# EAGLE board Fuel Cell Controller V1 (EAGLE 7.7.0)
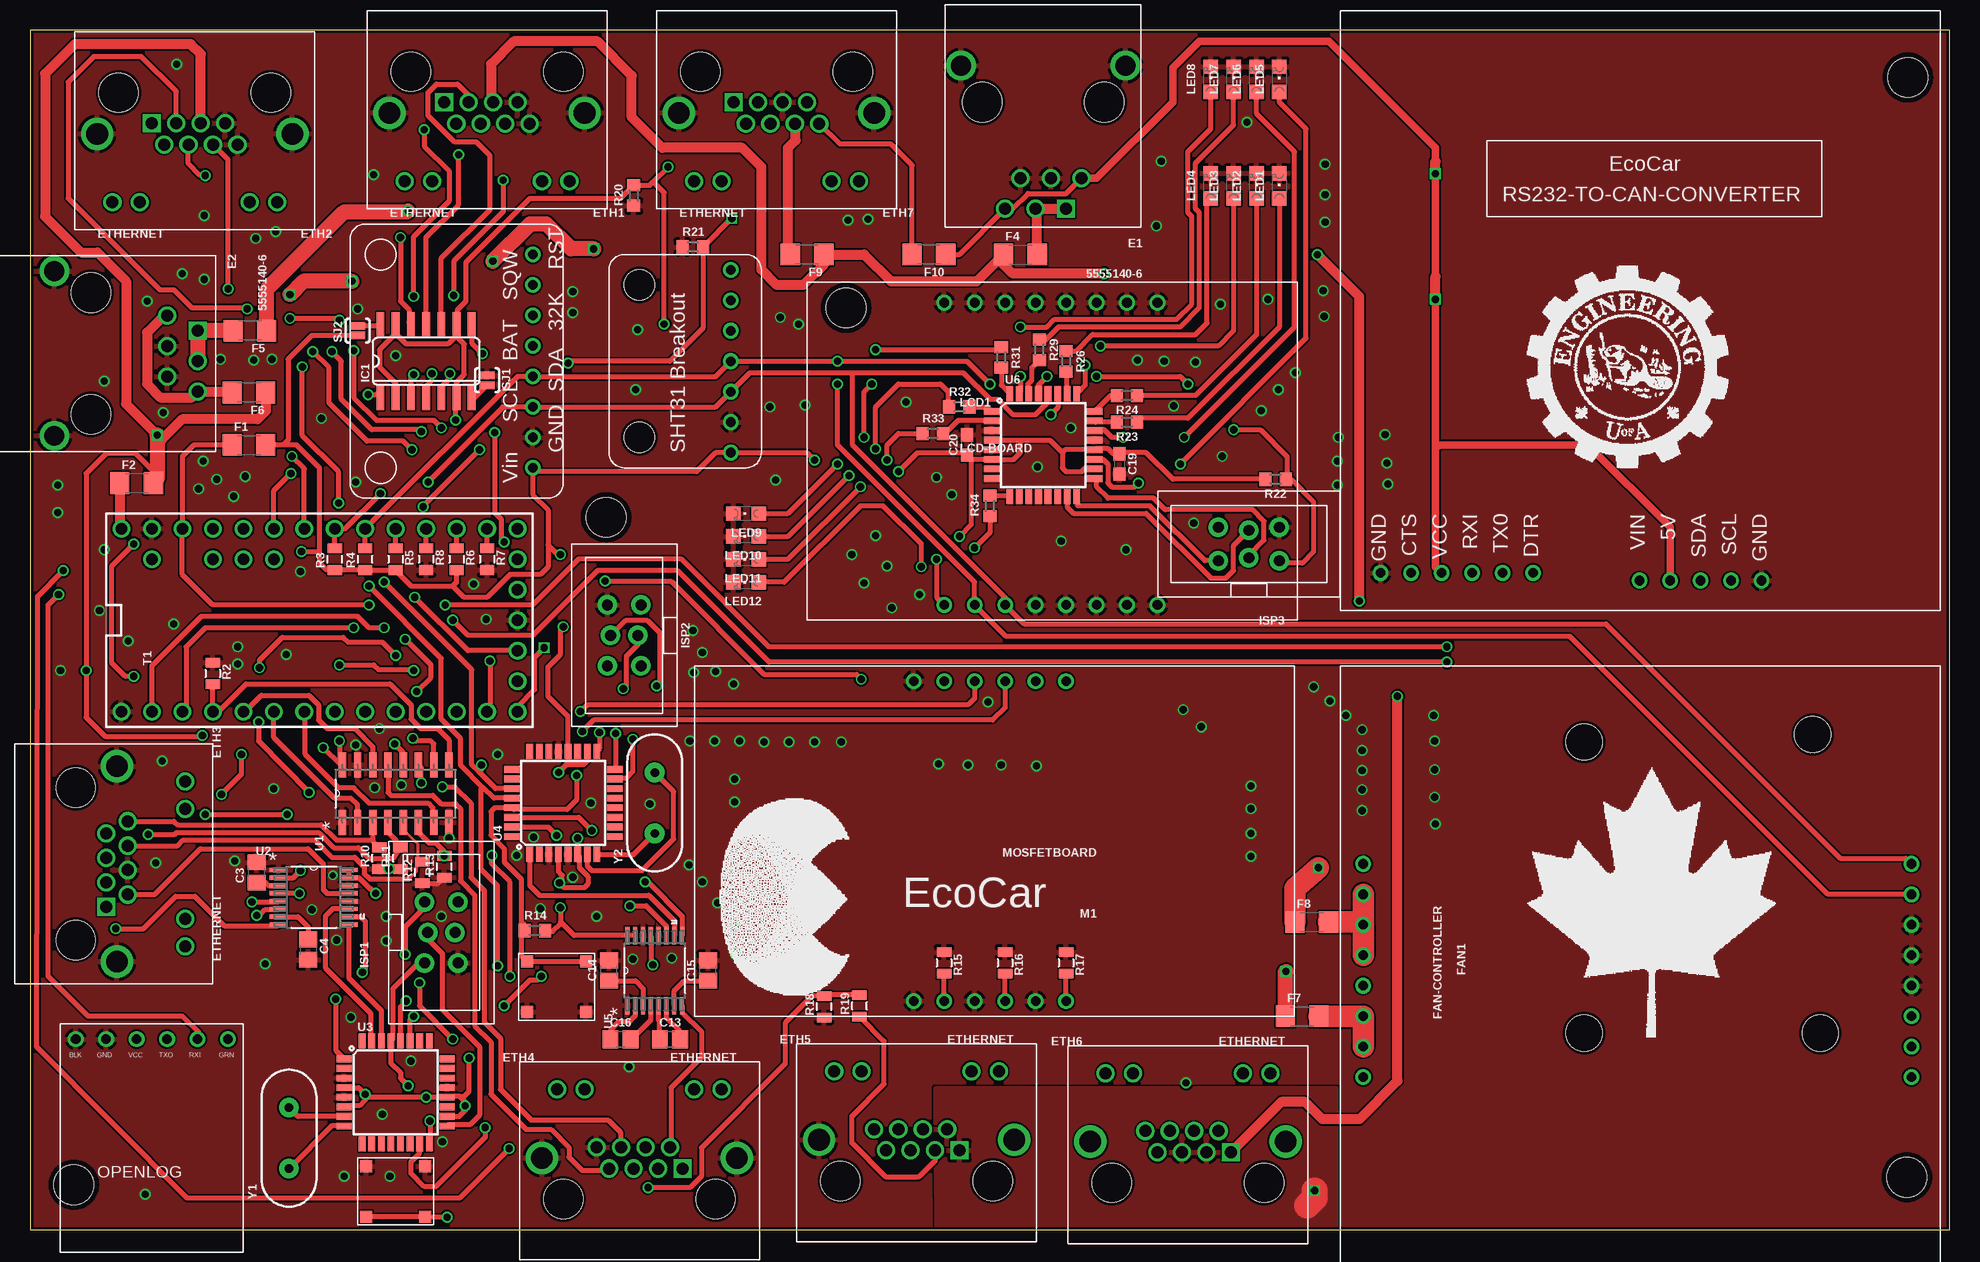
[diagram p7: board, top side]
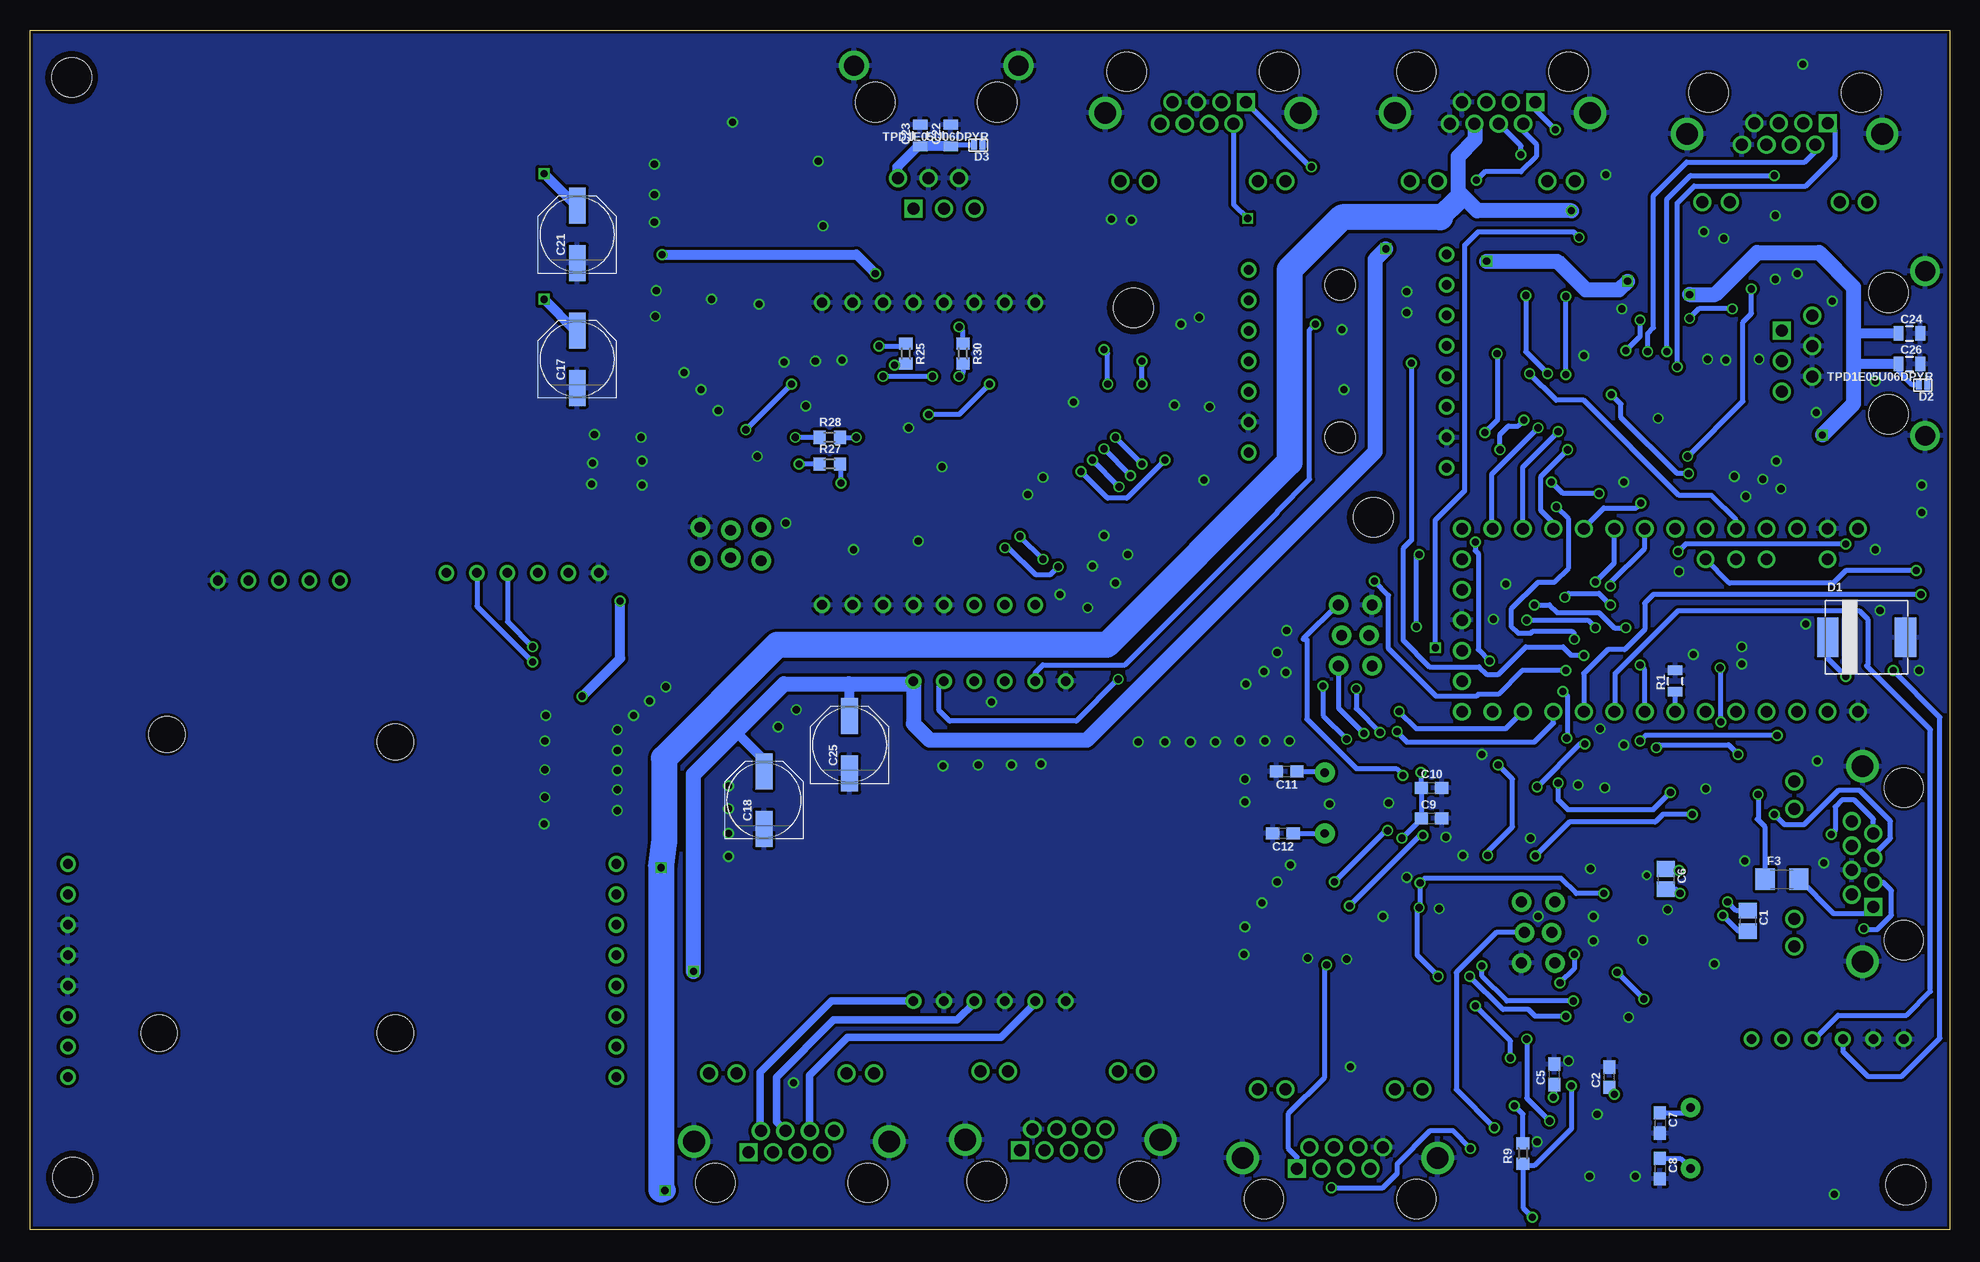
[diagram p8: board, bottom side, seen from below]

Size 160 x 100 mm. Coordinates in mm from the lower left corner, seen from the top.
Outline: 0,0 160,0 160,100 0,100 0,0
Copper layers (1*16): Top 0.035mm / dielectric 1.5mm / Bottom 0.035mm
Design rules "SeeedStudio_2layer_DRU_no_angle_20140221": minimum track width 6mil, minimum drill 12mil, track to track 6mil, track to pad 6mil, pad to pad 6mil, via to via 6mil, smd to smd 0mil, copper to edge 10mil, drill to drill 10mil, minimum pad ring 10mil, minimum via ring 6mil, stop-mask expansion 2mil, vias tented up to drill 100mil, thermal gap 10mil

## Footprints (pad centres in the part's own frame; a part is rotated, then mirrored left to right if it is on the bottom)
C0805 = smd 1.3 x 1.5: 1 -0.85,0; 2 0.85,0
C0603 = smd 1.1 x 1: 1 -0.85,0; 2 0.85,0
PANASONIC_D = smd 3 x 1.4: + 2.4,0; - -2.4,0
0805 = smd 0.8 x 1.2: 1 -0.9,0; 2 0.9,0
RS232-TO-CAN-CONVERTER = drill 0.8: 5V 47.498,27.495; CTS 46.863,5.905; DTR 46.863,16.066; GND 46.863,3.365; GND_ 47.498,35.115; RXI 46.863,10.986; SCL 47.498,32.575; SDA 47.498,30.035; TX0 46.863,13.525; VCC 46.863,8.445; VIN 47.498,24.956
DO-214AB = smd 1.778 x 3.302: A 3.239,0; C -3.239,0
2-XDFN = smd 0.5 x 0.8: P$1 0.36,0; P$2 -0.36,0
1734723-1_RJ11 = drill 1 square: 1 -2.54,2.54 | drill 1: 2 0,2.54; 3 2.54,2.54; 4 -3.81,0; 5 -1.27,0; 6 1.27,0 | drill 1.65: SH1 -7.5,-9.4; SH2 6.22,-9.4 | hole 3.3: -5.72,-6.35; 4.44,-6.35
A122645-ND = drill 1 square: P$1 3.58,2.54 | drill 1: P$2 2.56,4.32; P$3 1.54,2.54; P$4 0.52,4.32; P$5 -0.5,2.54; P$6 -1.52,4.32; P$7 -2.54,2.54; P$8 -3.56,4.32; P$9 -6.86,9.14; P$10 -4.57,9.14; P$11 4.57,9.14; P$12 6.86,9.14 | drill 1.8: P$13 -8.13,3.43; P$14 8.13,3.43 | hole 3.25: -6.35,0; 6.35,0
1206 = smd 1.6 x 1.8: 1 -1.4,0; 2 1.4,0
FAN-CONTROLLER = drill 0.8: 5 31.75,1.905; 5_2 29.21,1.905; 12 19.05,1.905; 12_2 21.59,1.905; 12_3 24.13,1.905; GND 21.59,47.625; GND2 24.13,47.625; GND3 26.67,47.625; P$6 29.21,47.625; P$7 31.75,47.625; P$8 34.29,47.625; P$9 16.51,1.905; P$13 26.67,1.905; P$16 34.29,1.905; SCL 16.51,47.625; SDA 19.05,47.625 | hole 3: 6.35,20.32; 30.615,20.32; 5.715,39.37; 30.615,40.005
SO14 = smd 0.66 x 2.032: 1 -3.81,-3.073; 2 -2.54,-3.073; 3 -1.27,-3.073; 4 0,-3.073; 5 1.27,-3.073; 6 2.54,-3.073; 7 3.81,-3.073; 8 3.81,3.073; 9 2.54,3.073; 10 1.27,3.073; 11 0,3.073; 12 -1.27,3.073; 13 -2.54,3.073; 14 -3.81,3.073
AVRISP-BOX = drill 0.9 pad 1.626: 1 -1.397,2.54; 2 1.397,2.54; 3 -1.143,0; 4 1.143,0; 5 -1.397,-2.54; 6 1.397,-2.54
LCD-BOARD = drill 0.8: GND1 11.43,26.467; GND2 13.97,26.467; GND3 16.51,26.467; GND4 19.05,26.467; GND5 21.59,26.467; GND6 24.13,26.467; GND7 26.67,26.467; GND8 29.21,26.467; GND9 19.05,1.27; GND10 21.59,1.27; GND11 24.13,1.27; GND12 26.67,1.27; GND13 29.21,1.27; SCL 16.51,1.27; SDA 13.97,1.27; V 11.43,1.27
CHIPLED_0805 = smd 1.2 x 1.2: A 0,-1.05; C 0,1.05
MOSFET-BOARD = drill 0.8: ESTOP 29.21,1.27; GND 21.59,27.94; GND1 26.67,27.94; GND2 31.75,27.94; IN1 21.59,1.27; IN2 24.13,1.27; IN3 26.67,1.27; OUT1 19.05,27.94; OUT2 24.13,27.94; OUT3 29.21,27.94; VDD 19.05,1.27; VSS 31.75,1.27
OPENLOG = drill 0.8: P$1 -6.35,-8.255; P$2 -3.81,-8.255; P$3 -1.27,-8.255; P$4 1.27,-8.255; P$5 3.81,-8.255; P$6 6.35,-8.255
R0603 = smd 1 x 1.1: 1 -0.85,0; 2 0.85,0
DS3231 = drill 0.8: P$1 2.54,2.54; P$2 5.08,2.54; P$3 7.62,2.54; P$4 10.16,2.54; P$5 12.7,2.54; P$6 15.24,2.54; P$7 17.78,2.54; P$8 20.32,2.54
EG4621CT-ND = smd 1 x 1: P$1 -2.475,2.1; P$2 2.475,2.1; P$3 -2.475,-2.1; P$4 2.475,-2.1
SHT31-BREAKOUT = drill 0.8: ADR 11.43,2.54; ALR 16.51,2.54; GND 3.81,2.54; RST 13.97,2.54; SCL 6.35,2.54; SDA 8.89,2.54; VIN 1.27,2.54 | hole 2.54: 2.54,10.16; 15.24,10.16
PAD-JUMPER-2-NC_BY_PASTE_YES_SILK = smd 0.635 x 1.27: 1 -0.401,0; 2 0.413,0
STAND-OFF = hole 3.302: 0,0
TEENSY3-ALL_PINS = drill 0.965: 0 -7.62,13.97; 1 -7.62,11.43; 2 -7.62,8.89; 3 -7.62,6.35; 3.3V 7.62,11.43; 3.3V1 -2.54,-16.51; 4 -7.62,3.81; 5 -7.62,1.27; 6 -7.62,-1.27; 7 -7.62,-3.81; 8 -7.62,-6.35; 9 -7.62,-8.89; 10 -7.62,-11.43; 11 -7.62,-13.97; 12 -7.62,-16.51; 13 7.62,-16.51; 14/A0 7.62,-13.97; 15/A1 7.62,-11.43; 16/A2 7.62,-8.89; 17/A3 7.62,-6.35; 18/A4 7.62,-3.81; 19/A5 7.62,-1.27; 20/A6 7.62,1.27; 21/A7 7.62,3.81; 22/A8 7.62,6.35; 23/A9 7.62,8.89; A10 5.08,6.35; A11 5.08,3.81; AGND 7.62,13.97; AREF 5.08,8.89; GND -7.62,16.51; GND1 0,-16.51; PGM 2.54,-16.51; RESET/DAC 5.08,-16.51; VBAT -5.08,-16.51; VIN 7.62,16.51; VUSB 5.08,13.97
SOIC127P600X175-16N = smd 2.057 x 0.61: 1 -4.801,8.89; 2 -4.801,7.62; 3 -4.801,6.35; 4 -4.801,5.08; 5 -4.801,3.81; 6 -4.801,2.54; 7 -4.801,1.27; 8 -4.801,0; 9 0,0; 10 0,1.27; 11 0,2.54; 12 0,3.81; 13 0,5.08; 14 0,6.35; 15 0,7.62; 16 0,8.89
SOP65P640X120-16N = smd 1.473 x 0.356: 1 -2.921,2.286; 2 -2.921,1.626; 3 -2.921,0.965; 4 -2.921,0.33; 5 -2.921,-0.33; 6 -2.921,-0.965; 7 -2.921,-1.626; 8 -2.921,-2.286; 9 2.921,-2.286; 10 2.921,-1.626; 11 2.921,-0.965; 12 2.921,-0.33; 13 2.921,0.33; 14 2.921,0.965; 15 2.921,1.626; 16 2.921,2.286
TQFP32-08 = smd 1.27 x 0.559: 1 -4.293,2.8; 2 -4.293,2; 3 -4.293,1.2; 4 -4.293,0.4; 5 -4.293,-0.4; 6 -4.293,-1.2; 7 -4.293,-2; 8 -4.293,-2.8; 17 4.293,-2.8; 18 4.293,-2; 19 4.293,-1.2; 20 4.293,-0.4; 21 4.293,0.4; 22 4.293,1.2; 23 4.293,2; 24 4.293,2.8 | smd 0.559 x 1.27: 9 -2.8,-4.293; 10 -2,-4.293; 11 -1.2,-4.293; 12 -0.4,-4.293; 13 0.4,-4.293; 14 1.2,-4.293; 15 2,-4.293; 16 2.8,-4.293; 25 2.8,4.293; 26 2,4.293; 27 1.2,4.293; 28 0.4,4.293; 29 -0.4,4.293; 30 -1.2,4.293; 31 -2,4.293; 32 -2.8,4.293
HC49US = drill 0.7 pad 1.651: 1 -2.54,0; 2 2.54,0

## Placement (x,y rotation side)
C1  0.1uF/12V  [C0805]  16.83,25.72 270 bottom
C2  10uF  [C0603]  28.34,12.7 90 bottom
C3  0.1uF/12V  [C0805]  18.89,29.77 90 top
C4  0.1uF/12V  [C0805]  23.18,23.34 270 top
C5  0.1uF  [C0603]  32.94,12.94 90 bottom
C6  0.1uF/12V  [C0805]  23.65,29.21 270 bottom
C7  22pF  [C0603]  24.13,8.89 270 bottom
C8  22pF  [C0603]  24.13,5.08 270 bottom
C9  0.1uF  [C0603]  43.18,34.29 0 bottom
C10  10uF  [C0603]  43.18,36.83 0 bottom
C11  22pF  [C0603]  55.24,38.18 180 bottom
C12  22pF  [C0603]  55.56,33.02 180 bottom
C13  0.1uF/12V  [C0805]  53.34,15.88 0 top
C14  0.1uF/12V  [C0805]  48.26,21.59 90 top
C15  0.1uF/12V  [C0805]  56.52,21.59 90 top
C16  0.1uF/12V  [C0805]  49.21,15.88 0 top
C17  100uF  [PANASONIC_D]  114.38,72.55 90 bottom
C18  100uF  [PANASONIC_D]  98.82,35.8 90 bottom
C19  0.1uF  [C0603]  90.81,63.82 270 top
C20  10uF  [C0603]  78.11,65.41 90 top
C21  100uF  [PANASONIC_D]  114.38,82.95 90 bottom
C22  10uF  [0805]  83.26,91.2 90 bottom
C23  10uF  [0805]  85.8,91.2 90 bottom
C24  10uF  [0805]  3.33,74.69 0 bottom
C25  100uF  [PANASONIC_D]  91.68,40.4 90 bottom
C26  10uF  [0805]  3.33,72.15 0 bottom
CAN1  RS232-TO-CAN-CONVERTER  [RS232-TO-CAN-CONVERTER]  109.22,101.6 270 top
D1  SMBJ3V3(digikey)  [DO-214AB]  6.91,49.37 0 bottom
D2  TPD1E05U06DPYR  [2-XDFN]  2.22,70.41 180 bottom
D3  TPD1E05U06DPYR  [2-XDFN]  80.96,90.41 180 bottom
E1  5555140-6  [1734723-1_RJ11]  83.82,87.63 180 top
E2  5555140-6  [1734723-1_RJ11]  11.43,72.39 270 top
ETH1  ETHERNET  [A122645-ND]  38.1,96.52 180 top
ETH2  ETHERNET  [A122645-ND]  13.73,94.77 180 top
ETH3  ETHERNET  [A122645-ND]  3.81,30.48 270 top
ETH4  ETHERNET  [A122645-ND]  50.8,2.54 0 top
ETH5  ETHERNET  [A122645-ND]  73.9,4.05 0 top
ETH6  ETHERNET  [A122645-ND]  96.52,3.89 0 top
ETH7  ETHERNET  [A122645-ND]  62.23,96.52 180 top
F1  [1206]  18.26,65.41 0 top
F2  [1206]  8.89,62.23 0 top
F3  [1206]  13.97,29.21 0 bottom
F4  [1206]  82.55,81.28 0 top
F5  [1206]  18.34,74.93 180 top
F6  [1206]  18.26,69.77 180 top
F7  [1206]  106.05,17.78 0 top
F8  [1206]  106.84,25.64 0 top
F9  [1206]  64.77,81.28 180 top
F10  [1206]  74.93,81.28 180 top
FAN1  FAN-CONTROLLER  [FAN-CONTROLLER]  109.22,46.99 270 top
FRAME1  FRAME-LETTERNO_PACKAGE  [DUMMY]  -1.27,2.54 0 top
FRAME2  FRAME-LETTERNO_PACKAGE  [DUMMY]  -1.27,2.54 0 top
FRAME3  FRAME-LETTERNO_PACKAGE  [DUMMY]  -1.27,2.54 0 top
FRAME4  FRAME-LETTERNO_PACKAGE  [DUMMY]  0,1.27 0 top
FRAME5  FRAME-LETTERNO_PACKAGE  [DUMMY]  -1.27,2.54 0 top
FRAME6  FRAME-LETTERNO_PACKAGE  [DUMMY]  -1.27,2.54 0 top
FRAME7  FRAME-LETTERNO_PACKAGE  [DUMMY]  -1.91,1.91 0 top
IC1  4081D  [SO14]  33.02,72.39 0 top
ISP1  AVRISP-BOX  [AVRISP-BOX]  34.29,24.77 0 top
ISP2  AVRISP-BOX  [AVRISP-BOX]  49.53,49.53 180 top
ISP3  AVRISP-BOX  [AVRISP-BOX]  101.6,57.15 90 top
LCD1  LCD-BOARD  [LCD-BOARD]  64.77,50.8 0 top
LED1  [CHIPLED_0805]  104.14,87 0 top
LED2  [CHIPLED_0805]  102.23,87 0 top
LED3  [CHIPLED_0805]  100.33,87 0 top
LED4  [CHIPLED_0805]  98.42,87 0 top
LED5  [CHIPLED_0805]  104.14,95.89 0 top
LED6  [CHIPLED_0805]  102.23,95.89 0 top
LED7  [CHIPLED_0805]  100.33,95.89 0 top
LED8  [CHIPLED_0805]  98.42,95.89 0 top
LED9  [CHIPLED_0805]  59.69,59.69 90 top
LED10  [CHIPLED_0805]  59.69,57.78 90 top
LED11  [CHIPLED_0805]  59.69,55.88 90 top
LED12  [CHIPLED_0805]  59.69,53.98 90 top
M1  MOSFETBOARD  [MOSFET-BOARD]  105.41,46.99 180 top
O1  OPENLOG  [OPENLOG]  10.16,7.62 180 top
R1  10k  [0805]  22.86,45.72 90 bottom
R2  10k  [0805]  15.24,46.35 270 top
R3  4.7k  [0805]  25.4,55.88 90 top
R4  4.7k  [0805]  27.94,55.88 90 top
R5  1M  [0805]  30.48,55.88 270 top
R6  1M  [0805]  35.56,55.88 270 top
R7  1M  [0805]  38.1,55.88 270 top
R8  1M  [0805]  33.02,55.88 270 top
R9  10k  [R0603]  35.56,6.35 90 bottom
R10  10k  [0805]  29.13,30.96 90 top
R11  10k  [0805]  30.88,30.96 90 top
R12  10k  [0805]  32.7,29.77 90 top
R13  10k  [0805]  34.53,30.24 90 top
R14  10k  [R0603]  42.07,24.92 0 top
R15  10k  [0805]  76.2,22.23 270 top
R16  10k  [0805]  81.28,22.23 270 top
R17  10k  [0805]  86.36,22.23 270 top
R18  10k  [0805]  66.2,18.57 90 top
R19  10k  [0805]  69.14,18.65 90 top
R20  10k  [R0603]  50.32,86.2 90 top
R21  10k  [R0603]  55.24,81.92 0 top
R22  10k  [R0603]  103.82,62.55 180 top
R23  100  [R0603]  91.44,67.31 180 top
R24  100  [R0603]  91.44,69.53 180 top
R25  100  [R0603]  87,73.03 270 bottom
R26  100  [R0603]  86.36,72.39 270 top
R27  100  [R0603]  93.34,63.82 0 bottom
R28  100  [R0603]  93.34,66.04 0 bottom
R29  100  [R0603]  84.14,73.34 270 top
R30  100  [R0603]  82.23,73.03 270 bottom
R31  100  [R0603]  80.96,72.71 270 top
R32  100  [R0603]  77.47,68.58 0 top
R33  100  [R0603]  75.25,66.36 0 top
R34  100  [R0603]  80.01,60.33 90 top
RTC1  DS3231  [DS3231]  44.45,60.96 90 top
S1  EG4621CT-ND  [EG4621CT-ND]  30.48,3.17 0 top
S2  EG4621CT-ND  [EG4621CT-ND]  43.89,20.24 180 top
SHT1  SHT31-BREAKOUT  [SHT31-BREAKOUT]  60.96,63.5 90 top
SJ1  JUMPER-PAD-2-NC_BY_PASTE  [PAD-JUMPER-2-NC_BY_PASTE_YES_SILK]  38.1,70.8 270 top
SJ2  JUMPER-PAD-2-NC_BY_PASTE  [PAD-JUMPER-2-NC_BY_PASTE_YES_SILK]  27.3,74.93 90 top
STANDOFF1  STAND-OFF  [STAND-OFF]  156.45,4.37 0 top
STANDOFF2  STAND-OFF  [STAND-OFF]  3.65,3.73 0 top
STANDOFF3  STAND-OFF  [STAND-OFF]  156.53,96.04 0 top
STANDOFF4  STAND-OFF  [STAND-OFF]  48.02,59.37 0 top
STANDOFF5  STAND-OFF  [STAND-OFF]  68.02,76.83 0 top
T1  TEENSY_3.1_ALL_PINS  [TEENSY3-ALL_PINS]  24.13,50.8 90 top
U1  SN74ALS153D  [SOIC127P600X175-16N]  34.92,38.73 90 top
U2  MAX3221CPWR  [SOP65P640X120-16N]  23.65,27.7 0 top
U3  ATMEGA328P_TQFP  [TQFP32-08]  30.48,11.43 0 top
U4  ATMEGA328P_TQFP  [TQFP32-08]  44.45,35.56 90 top
U5  MAX3221CPWR  [SOP65P640X120-16N]  52.07,21.59 90 top
U6  ATMEGA328P_TQFP  [TQFP32-08]  84.45,65.41 0 top
Y1  [HC49US]  21.59,7.62 90 top
Y2  [HC49US]  52.07,35.56 90 top

## Tracks (layer width: path | path; a pad name or v marks a point on that pad's centre or on a via)
+3.3V  (via drill 0.6)
  Top 0.406: 35.24,53.66 31.75,53.66 30.48,54.93 R5.2 R4.1 R3.1 24.71,54.98 24.13,55.56 24.13,56.59 | 35.24,53.66 35.56,53.98 R6.2 | 24.13,56.59 24.13,63.5 22.23,65.41 21.11,65.41 | 21.11,65.41 F1.2 | 86.04,64.77 86.28,65 U6.20 88.83,65.09 89.85,65.09 90.27,64.67 C19.1 90.91,64.77 93.03,64.77 95.25,62.55 R22.2 | 86.04,64.77 86.04,63.5 86.36,63.18 87.63,63.18 87.95,63.5 88.65,63.5 U6.18 | U6.4 82.55,65.81 | 82.55,65.81 85.01,65.81 86.04,64.77 | 82.55,65.81 82.55,64.77 81.98,64.2 U6.6 78.45,64.2 | 78.45,64.2 C20.1 77.89,64.77 73.98,64.77 v72.39,63.18 | 78.45,64.2 78.45,58.77 v77.47,57.78 | v75.56,55.88 75.56,52.7 LCD1.V | v65.41,64.14 64.77,64.77 SHT1.VIN 57.15,64.77 55.56,63.18 42.23,63.18 RTC1.P$1 41.91,61.28 43.18,60.01 43.18,57.07 | 43.18,57.07 43.18,55.24 42.55,54.61 40.01,54.61 38.1,52.7 36.2,52.7 35.24,53.66 | SJ2.1 23.49,74.53 21.51,72.55 21.51,65.8 21.11,65.41 | v44.45,50.24 44.21,50.01 44.21,47.94 43.18,46.91 43.18,44.45 44.85,42.78 U4.20 44.93,39.78 44.93,38.81 45.01,38.73 | v44.21,56.28 43.97,56.28 43.18,57.07 | U3.4 27.38,11.83 v27.94,11.27 | v27.94,11.27 27.94,10.79 | 27.94,10.79 27.46,10.32 26.28,10.32 U3.6 | U4.18 46.45,39.07 46.12,38.73 45.01,38.73 | 45.01,38.73 44.69,38.73 v44.05,38.1 | v45.64,32.62 U4.6 45.8,31.12 45.8,30.16 46.51,29.45 46.51,28.81 46.2,28.5 44.53,28.5 v44.13,28.89 | U4.4 44.05,29.84 44.37,29.53 44.37,29.13 v44.13,28.89 | v44.21,26.83 44.21,25.64 | 44.21,25.64 44.21,25.48 43.58,24.84 43,24.84 R14.2 | U5.15 U5.16 45.34,24.51 44.21,25.64 | U2.16 U2.15 27.43,29.33 28.34,28.42 28.42,28.42 v28.81,28.02 | U3.18 35.78,9.43 36.27,9.92 v36.27,10.32 36.27,10.64 35.8,11.11
  Top 0.406: 35.8,11.11 34.85,11.11 U3.20 v33.02,11.03 28.34,11.03 | 28.34,11.03 28.18,11.03 27.94,10.79 | v27.94,11.27 28.1,11.27 28.34,11.03 | 35.8,11.11 36.2,11.11 36.59,11.51 v36.59,14.29 | v39.53,18.65 41.67,20.8 42.31,20.8 v42.62,21.11 | 44.29,28.73 v44.13,28.89 | v8.65,46.12 7.94,46.12 6.83,47.23 6.83,55.32 v8.65,57.15 | v22.62,56.52 24.05,56.52 24.13,56.59
  Bottom 0.406: v77.47,57.78 v75.56,55.88 | v65.41,64.14 68.58,60.96 70.17,60.96 v72.39,63.18 | v44.45,50.24 44.45,56.04 v44.21,56.28 | v44.05,38.1 44.05,36.85 C10.1 C9.1 44.03,34.23 v45.64,32.62 | v28.81,28.02 31.11,28.02 32.38,29.29 43.74,29.29 v44.13,28.89 44.13,26.91 v44.21,26.83 44.37,26.67 44.37,22.86 v42.62,21.11 | C5.1 32.94,11.11 v33.02,11.03 | C2.1 28.34,11.67 v27.94,11.27 | R9.2 35.56,9.6 v36.27,10.32 | v36.59,14.29 36.59,15.72 v39.53,18.65 | D1.C 10.14,47.61 v8.65,46.12 | v8.65,57.15 21.99,57.15 v22.62,56.52
ATMEG1_RESET  (via drill 0.6)
  Top 0.406: ISP1.5 32.38,22.23 30.24,20.08 30.24,15.88 U3.29 30.08,13.89 30.88,13.1 30.88,12.62 v31.51,11.99 | v34.77,1.03 33,1.03 S1.P$4 S1.P$3
  Bottom 0.406: v31.51,11.99 31.51,8.41 34.61,5.32 35.38,5.32 R9.1 35.56,1.83 v34.77,1.03
ATMEG2_RESET  (via drill 0.6)
  Top 0.406: v45.56,37.86 45.56,35.8 44.77,35 40.31,35 U4.29 38.73,35.16 38.42,34.85 38.42,32.86 39.53,31.75 39.53,30.64 40.96,29.21 40.96,25.64 | 40.96,25.64 40.96,22.8 S2.P$4 S2.P$3 | R14.1 41.22,25.38 40.96,25.64
  Bottom 0.406: ISP2.5 51.04,52.07 53.9,49.21 53.74,49.21 53.66,49.13 53.58,49.21 53.58,42.55 49.45,38.42 46.12,38.42 v45.56,37.86
ATMEG3_RESET  (via drill 0.6)
  Top 0.406: ISP3.5 104.33,55.56 106.05,55.56 107,56.52 107,60.64 105.09,62.55 R22.1 104.78,62.65 104.78,64.45 102.55,66.67 v100.33,66.67 | U6.29 84.06,70.4 v84.77,71.12 | v88.9,71.12 95.89,71.12 v96.52,70.48
  Bottom 0.406: v84.77,71.12 v88.9,71.12 | v96.52,70.48 v100.33,66.67
AUX5  (via drill 0.6)
  Top 0.406: F10.1 77.47,81.28 E1.3 81.92,85.09 83.19,86.36 86.36,86.36 E1.4
  Top 0.61: E1.4 88.9,87.63 95.25,93.98 95.25,96.84 97.47,99.06 108.27,99.06 117.16,90.17 117.16,89.06 | v117.16,88.03 117.16,79.45 | v117.16,77.55 117.16,65.09 | CAN1.VCC 117.16,55.24 117.16,65.09 | 117.16,65.09 117.47,65.41 129.86,65.41 136.72,58.55 CAN1.5V
  Top 0.813: v117.16,77.55 117.16,79.45 | v117.16,88.03 117.16,89.06
  Bottom 0.406: D3.P$1 83.16,90.41 C22.1
  Bottom 0.813: C17.+ 114.56,74.95 v117.16,77.55 | C21.+ 114.48,85.35 v117.16,88.03 | C23.1 C22.1 85.99,90.3 87.71,88.58 87.71,87.71 E1.4
AUX12  (via drill 0.6)
  Top 0.813: 80.74,80.87 78.93,79.06 71.75,79.06 69.53,81.28 F9.1 66.17,80.46 64.45,78.74 62.23,78.74 60.96,80.01 60.96,88.58 59.37,90.17 52.7,90.17 50.16,92.71 50.16,96.2 47.31,99.06 40.32,99.06 38.42,97.16 38.42,94.16 ETH1.P$5 | 80.74,80.87 F4.1 | v113.98,44.45 113.98,12.38 110.81,9.21 107.71,9.21 106.28,10.64 104.31,10.64 ETH6.P$1 | v110.81,52.39 110.81,77.79 v107.31,81.28 | v89.53,79.69 81.92,79.69 80.74,80.87
  Bottom 0.813: v110.81,52.39 110.81,47.62 v113.98,44.45 | v107.31,81.28 91.12,81.28 v89.53,79.69
CAP_R  (via drill 0.6)
  Top 0.406: IC1.8 36.83,73.9 v37.7,73.03 | v38.73,66.44 38.73,59.77 39.29,59.21 39.29,57.55 v39.53,57.31 | v38.34,47.39 38.34,43.42 T1.11
  Bottom 0.406: v37.7,73.03 37.7,67.47 v38.73,66.44 | v39.53,57.31 39.53,56.59 39.29,56.36 39.29,48.34 v38.34,47.39
CAP_R_OUT
  Top 0.406: ETH1.P$3 36.51,94.03 36.51,94.61 35.64,95.49 33.89,95.49 33.18,94.77 33.18,92.87 35.4,90.65 37.23,90.65 38.34,89.53 38.34,85.01 34.29,80.96 IC1.10
CAPCURR  (via drill 0.6)
  Top 0.406: R5.1 T1.17/A3 | v25.72,60.56 25.72,63.18 22.7,66.2 v22.7,71.91
  Bottom 0.406: T1.17/A3 30.48,58.5 28.81,60.17 26.11,60.17 v25.72,60.56 | v22.7,71.91 22.7,85.57 21.27,87 11.99,87 9.53,89.46 9.53,91.61 ETH2.P$1
CAPVOLT  (via drill 0.6)
  Top 0.406: R7.1 T1.14/A0 | ETH2.P$3 12.19,94.89 9.29,97.79 5.32,97.79 3.17,95.65 3.17,85.96 10.79,78.34 11.99,78.34 13.49,76.83 18.02,76.83 v18.1,76.76 | v21.67,75.96 25.64,75.96 v25.8,75.8 | v26.99,73.26 26.99,69.37 28.89,67.47 33.66,67.47 v34.29,66.83
  Bottom 0.406: v18.1,76.76 20.88,76.76 v21.67,75.96 | v25.8,75.8 25.8,74.45 v26.99,73.26 | v34.29,66.83 38.18,62.94 38.18,58.5 T1.14/A0
CHARGE_R  (via drill 0.6)
  Top 0.406: T1.12 40.64,43.58 42.07,45.01 42.07,47.7 v42.86,48.5 | v30.88,82.71 30.88,77.39 31.59,76.68 31.59,75.62 IC1.12
  Bottom 0.406: v42.86,48.5 42.86,59.13 40.4,61.59 40.4,82.07 39.29,83.19 31.35,83.19 v30.88,82.71
CHARGE_R_OUT  (via drill 0.6)
  Top 0.406: IC1.11 33.02,82.71 35.72,85.41 v35.72,89.61
  Bottom 0.406: v35.72,89.61 35.72,90.34 ETH1.P$4
CVM_SER_INVALID  (via drill 0.6)
  Top 0.406: U2.10 27.58,26.08 27.94,25.72 27.94,21.67 v27.7,21.43 | 25.8,14.62 U3.1 25.48,14.94 v25.48,19.21
  Bottom 0.406: v27.7,21.43 v25.48,19.21
CVMRX
  Top 0.406: U2.9 26.57,20.97 29.29,18.26 29.29,15.73 U3.30
CVMRX12  (via drill 0.6)
  Top 0.406: v7.14,25.08 9.45,25.08 12.14,27.78 13.73,27.78 16.19,25.32 20.64,25.32 U2.8
  Bottom 0.406: ETH3.P$3 5.52,28.94 4.84,28.26 4.84,26.19 6.03,25 7.06,25 v7.14,25.08
CVMSIG1  (via drill 0.6)
  Top 0.406: U1.6 32.38,33.1 33.26,32.23 33.81,32.23 34.37,31.67 | 34.37,31.67 R13.2 34.53,31.51 34.37,31.67 | v14.61,34.61 v21.43,34.61
  Bottom 0.406: ETH3.P$5 6.35,31.19 4.92,32.62 4.92,34.05 7.46,36.59 9.29,36.59 12.14,33.73 13.73,33.73 v14.61,34.61 | v21.43,34.61 23.89,34.61 24.53,33.97 31.7,33.97 R13.2
  other vias: 34.53,31.14
CVMSIG2
  Top 0.254: 31.11,33.1 31.35,33.1 32.31,32.15 32.31,31.06 R12.2 32.23,30.19 32.23,29.84 31.59,29.21
  Top 0.406: U1.5 31.11,33.1 | ETH3.P$6 12.31,32 12.78,32.46 23.73,32.46 25.16,31.04 27.07,31.04 27.86,30.24 27.86,29.69 28.34,29.21 31.59,29.21
CVMSIG3  (via drill 0.6)
  Top 0.406: U1.4 29.84,33.1 30.48,32.46 30.48,31.94 R11.2 30.29,30.96 28.26,30.96 27.38,31.83 25.32,31.83 24.05,33.1 12.22,33.1 12.06,32.94 v9.84,32.94
  Bottom 0.406: ETH3.P$7 6.35,34.21 7.94,35.8 8.97,35.8 9.53,35.24 9.53,33.26 v9.84,32.94
CVMSIG4
  Top 0.406: U1.3 28.57,32.41 | 28.57,32.41 R10.2 | ETH3.P$8 12,34.04 12.3,33.73 24.29,33.73 25.56,32.46 28.52,32.46 28.57,32.41
CVMTX
  Top 0.406: U2.11 25.23,26.74 24.61,26.11 24.61,21.83 28.42,18.02 28.42,15.79 U3.31
CVMTX12
  Top 0.406: ETH3.P$2 10.38,27.92 14.21,31.75 23.18,31.75 24.45,30.48 24.45,28.34 24.77,28.02 26.56,28.02 U2.13
EXTRA_SIG  (via drill 0.6)
  Top 0.406: v58.5,84.3 58.48,84.3 R21.2 56.09,75.14 53.34,72.39 45.01,72.39 v44.85,72.23 | v19.05,42.31 19.05,40.72 v23.26,36.43 | v32.62,37.23 32.62,38.5 U1.11 | v19.13,46.83 19.13,47.47 21.03,49.37 26.11,49.37 26.51,48.97 29.37,48.97 v30.48,47.86
  Bottom 0.406: ETH7.P$2 59.67,85.47 v58.5,84.3 | v44.85,72.23 44.85,57.47 45.56,56.75 45.56,49.13 43.34,46.91 39.21,46.91 38.58,46.28 37.62,46.28 35.32,48.58 32.23,48.58 31.51,47.86 v30.48,47.86 | v32.62,37.23 32.62,35.8 31.83,35 24.69,35 v23.26,36.43 | v19.05,42.31 19.05,46.75 v19.13,46.83
EXTRA_V  (via drill 0.6)
  Top 0.406: M1.IN3 78.74,44.29 78.18,43.74 46.43,43.74 v45.88,43.18
  Bottom 0.406: v45.88,43.18 44.45,41.75 36.99,41.75 T1.10
EXTRA_V_G
  Top 0.406: M1.OUT3 R15.2
  Bottom 0.61: M1.OUT3 76.2,18.89 79.06,16.03 91.84,16.03 95.01,12.86 95.01,8.22 ETH6.P$6
FC5  (via drill 0.6)
  Top 0.406: F2.2 10.29,63.21 8.81,64.69 6.35,64.69 4.68,63.02 v4.68,46.59 4.68,42.7 6.27,41.12 14.29,41.12 v14.37,41.2 | v25.8,40.72 25.8,38.97 U1.16 25.88,38.73 v24.45,40.16 | v17.62,39.61 17.62,37.94 v15.95,36.27
  Top 0.813: F6.1 19.66,68.23 18.97,67.55 12.7,67.55 10.99,65.84 | 10.99,65.84 10.48,65.33 10.48,62.42 F2.2 | ETH2.P$5 14.23,98 13.41,98.82 3.73,98.82 1.27,96.36 1.27,84.45 4.29,81.44 5.64,81.44 8.02,79.06 8.02,68.82 v10.6,66.24 10.99,65.84
  Top 1.27: F7.1 104.64,21.46 v104.7,21.51 | v46.99,81.76 45.09,81.76 43.02,83.82 41.67,83.82 v38.58,80.72 | v26.83,79.06 22.78,79.06 v21.67,77.95 | v10.6,66.24 10.6,62.54 F2.2
  Bottom 0.406: v14.37,41.2 25.32,41.2 v25.8,40.72 | v24.45,40.16 24.21,40.4 18.41,40.4 v17.62,39.61 | O1.P$4 8.89,14.84 6.83,12.78 3.97,12.78 0.79,15.95 0.79,42.7 v4.68,46.59 | F3.1 15.37,33.55 16.03,34.21 15.95,34.29 v15.95,36.27 | D2.P$1 3.1,70.41 4.21,71.52 4.21,72.12 C26.1
  Bottom 0.813: C18.+ 98.82,39.13 101.16,41.47 | C25.+ 91.68,45.4 91.76,45.48 | C24.1 7.54,74.69 8.02,75.17 | C26.1 7.94,72.15 8.02,72.07
  Bottom 1.27: v104.7,21.51 104.7,37.94 101.16,41.47 97.16,45.48 91.76,45.48 86.6,45.48 M1.VDD 86.36,42.15 85.01,40.8 71.91,40.8 47.86,64.85 47.86,80.88 v46.99,81.76 | v38.58,80.72 32.7,80.72 30.32,78.34 27.54,78.34 v26.83,79.06 | v21.67,77.95 19.53,77.95 16.03,81.44 10.87,81.44 8.02,78.58 8.02,75.17 8.02,72.07 8.02,68.82 v10.6,66.24
FC12  (via drill 0.6)
  Top 1.27: F5.1 19.74,78.39 26.19,84.85 31.43,84.85 v31.51,84.93
  Top 1.778: F8.1 105.44,28.45 v107.39,30.16
  Top 2.184: v107.08,3.25 107.08,2.62 106.44,1.98
  Bottom 1.27: v31.51,84.93 39.37,84.93 40.96,86.52 | 40.96,86.52 40.96,89.46 39.53,90.88 39.53,92.11 ETH1.P$6 | 40.96,86.52 40.96,85.88
  Bottom 1.778: 40.96,85.88 42.47,84.38 | 107.39,3.33 v107.08,3.25
  Bottom 2.184: 42.47,84.38 50.64,84.38 55.01,80.01 55.01,63.98 70.25,48.74 97.71,48.74 107.16,39.29 107.16,32.15 v107.39,30.16 107.39,3.33
  pour Top (rank 2): 75.56,-0.16 108.9,-0.16 108.9,11.75 75.49,11.75
FCC_R  (via drill 0.6)
  Top 0.406: T1.20/A6 22.86,63.42 v21.83,64.45 | v16.51,78.42 16.51,89.2 ETH2.P$6
  Bottom 0.406: v21.83,64.45 17.22,69.06 17.22,75.64 16.51,76.36 v16.51,78.42
FCCURR  (via drill 0.6)
  Top 0.406: R6.1 T1.15/A1 | v32.62,66.52 32.54,66.52 32.38,66.67 28.5,66.67 25.96,69.22 25.96,72.39 v25.16,73.18
  Bottom 0.406: T1.15/A1 35.56,63.58 v32.62,66.52 | v25.16,73.18 25.16,74.69 24.69,75.17 24.69,86.2 21.91,88.98 12.06,88.98 11.19,89.85 11.19,90.43 ETH2.P$2
FCPRES  (via drill 0.6)
  Top 0.406: R19.2 66.28,19.55 R18.2 65.19,19.47 62.94,17.22 62.94,13.81 55.96,6.83 55.96,4.45 55.01,3.49 v51.51,3.49 | v2.78,54.93 0.64,52.78 0.56,15.24 13.1,2.62 35.8,2.62 v39.93,6.75
  Bottom 0.406: v2.78,54.93 8.65,54.93 9.68,53.9 18.34,53.9 T1.A11 | v51.51,3.49 47.23,3.49 46.04,4.68 46.04,5.48 43.26,8.26 41.43,8.26 v39.93,6.75
FCVOLT  (via drill 0.6)
  Top 0.406: R8.1 T1.16/A2 | v31.83,65.01 31.11,65.72 28.1,65.72 24.92,68.9 24.92,71.83 v23.57,73.18 | v14.61,87.87 14.21,87.87 13.18,88.9 13.18,90.42 ETH2.P$4
  Bottom 0.406: T1.16/A2 33.02,58.9 34.05,59.93 34.05,62.79 v31.83,65.01 | v23.57,73.18 23.57,85.88 21.59,87.87 v14.61,87.87
GND  (via drill 0.5, 0.6)
  Top 0.406: v29.92,30.08 29.13,30.08 R10.1 | R12.1 34.05,28.87 R13.1
  other vias: 101.44,92.31 36.99,53.82 86.76,66.83 27.15,40.4 20.32,36.75 29.13,41.75 28.73,36.83 38.97,39.61 40.56,31.19 45.24,29.37 49.93,13.57 50.24,22.54 53.5,22.62 11.03,39.05 19.61,22.15 10.48,30.56 17.07,30.72 29.69,26.11 29.69,24.05 23.5,26.67 15.56,62.55 22.54,54.85 24.29,67.63 27.15,62.31 30.48,72.87 50.48,70.01 73.03,68.98 75.56,62.71 83.98,63.58 79.85,43.97 51.67,35.48 46.75,35.56 21.35,47.94 99.38,64.45 97.16,72.31 95.33,68.66 99.22,77.15 103.19,77.55 97,58.9 91.36,56.67 85.96,57.39 93.9,83.66 94.3,89.06 69.85,84.22 68.18,84.14 62.55,76.04 64.06,75.49 61.67,68.58 64.61,68.74 62.15,62.47 50.64,75.01 45.24,78.18 45.24,76.44 17.94,62.79 18.81,82.63 20.48,83.19 14.53,84.53 2.3,62.07 2.3,59.77 11.99,50.48 8.18,49.05 2.54,46.59 5.79,51.59 17.3,48.58 17.3,47.15 56.04,48.1 57.15,46.51 29.37,9.6 26.75,17.7 9.6,2.94 96.36,12.22 38.02,50.88 30.96,37.07 34.92,32.62 41.99,32.7 47.23,26.11 31.75,14.05 25.24,29.53 25.56,24.13 34.29,26.11 34.37,7.3 30,4.45 26.19,4.45 117.08,38.34 117.08,36.04 117.16,33.81 117.08,40.72 101.76,36.99 101.76,35.08 101.76,33.02 101.76,31.11 107,45.24 108.35,44.05 109.7,42.86 111.05,41.67 111.05,39.93 111.05,38.26 111.05,36.67 111.05,34.92 117,42.86 55.32,46.43 58.66,45.48 67.63,40.64 65.41,40.64 63.26,40.64 61.2,40.64 59.13,40.72 57.07,40.72 55.01,40.72 55.24,49.93 70.48,57.86 68.5,56.28 71.83,51.83 74.14,52.94 69.53,53.9 71.44,55.32 58.74,37.54 58.74,35.64 54.93,30.4 56.04,28.97 57.31,27.23 58.74,25.24 58.82,22.94 83.9,38.66 80.96,38.73 78.18,38.73 42.55,26.75 18.65,72.47 20.16,72.55 15.88,72.55 14.53,79.22 12.7,79.69 9.76,77.39 11.11,68.1 6.19,70.72 16.99,61.12 14.45,64.06 14.05,61.75 6.19,56.67 27.3,76.76 28.65,87.95 94.54,72.39 92.31,72.47 102.63,68.26 104.06,70.01 105.49,71.44 107.79,78.26 107.87,76.12 107.95,83.98 107.95,86.28 107.95,88.82 76.83,61.28 112.95,66.28 113.11,63.9 113.19,62.15 109.06,66.04 108.98,64.06 108.98,62.07 97.63,41.91 96.12,43.34 75.72,38.81 12.22,97.16
  pour Bottom (isolate 0.254, rank 6): -3.81,104.78 162.56,104.78 162.56,-3.81 -3.81,-3.81
  pour Top (isolate 0.152, rank 6): -3.81,105.41 165.74,105.41 165.74,-3.17 -3.81,-3.17
H2_OK  (via drill 0.6)
  Top 0.406: IC1.13 30.48,74.69 | 30.48,74.69 29.13,73.34 29.13,71.91 30.48,70.56 IC1.2 | U1.10 33.66,40.48 33.42,40.72 32.15,40.72 v31.91,40.96 | v32.23,44.85 33.42,46.04 33.42,47.07 v31.27,49.21 | v32.78,60.25 32.78,60.33 v37.47,65.01 | v35.48,67.47 35.48,69.24 IC1.6 35.56,70.64 36.2,71.28 36.2,73.82 35.64,74.37 35.64,74.61 | 35.64,75.38 IC1.9 | 35.64,75.38 35.64,74.61 | 35.64,74.61 34.85,73.82 31.35,73.82 30.48,74.69 | 35.64,75.38 35.64,76.68 36.35,77.39 36.35,80.64 41.67,85.96 49.24,85.96 R20.2 51.65,87.05 51.95,87.35 | 51.95,87.35 v53.18,88.58 | v52.86,75.49 52.86,86.44 51.95,87.35
  Bottom 0.406: v31.91,40.96 31.83,41.04 31.83,44.45 v32.23,44.85 | v31.27,49.21 31.27,49.69 31.43,49.85 34.77,49.85 34.92,49.69 35.96,49.69 36.51,50.24 36.51,51.75 34.29,53.98 32.94,53.98 31.75,55.17 31.75,59.21 v32.78,60.25 | v37.47,65.01 37.47,66.28 36.75,66.99 35.96,66.99 v35.48,67.47 | v53.18,88.58 53.25,88.58 ETH7.P$1 | M1.ESTOP 76.2,46.43 75.56,47.07 68.74,47.07 56.04,59.77 56.04,59.85 53.34,62.55 53.34,75.01 v52.86,75.49
M_SER_INVALID
  Top 0.406: U4.1 41.65,28.68 42.47,27.86 51.59,27.86 53.74,25.72 53.74,24.55 U5.10
M_SIG_1  (via drill 0.6)
  Top 0.406: U1.12 31.11,39.77 v30.4,40.48 | v34.37,36.91 35.4,36.91 36.75,35.56 36.75,29.37 37.86,28.26 37.86,17.3 39.21,15.95 39.21,11.67 41.75,9.13 48.18,9.13 49.21,8.1 49.21,6.93 ETH4.P$6
  Bottom 0.406: v30.4,40.48 30.8,40.48 v34.37,36.91
M_SIG_2
  Top 0.406: U1.13 29.84,36.43 30.08,36.2 33.58,36.2 34.29,35.48 35.48,35.48 35.88,35.08 35.88,29.05 37.07,27.86 37.07,16.99 38.42,15.64 38.42,11.27 41.35,8.33 43.42,8.33 44.93,6.83 44.93,6.03 46.04,4.92 48.1,4.92 ETH4.P$7
MISO1  (via drill 0.6)
  Top 0.406: ISP1.1 32.89,26.86 31.27,25.24 v31.27,22.94 | v32.46,20.56 32.46,18.65 v35.24,15.88 | v33.34,9.05 33.34,7.2 U3.16
  Bottom 0.406: v31.27,22.94 31.27,21.75 v32.46,20.56 | v35.24,15.88 35.24,10.95 v33.34,9.05
MISO2  (via drill 0.6)
  Top 0.406: v48.82,41.35 48.82,38.43 U4.16
  Bottom 0.406: ISP2.1 50.93,43.47 v48.82,41.35
MISO3
  Top 0.406: ISP3.1 97.92,55.75 93.34,60.33 87.31,60.33 87.31,61.05 U6.16
MOSI1  (via drill 0.6)
  Top 0.406: v37.94,8.49 37.94,7.7 33.81,3.57 32.86,3.57 31.75,4.68 31.75,5.64 32.46,6.35 32.46,7.12 U3.15
  Bottom 0.406: ISP1.4 37.78,24.77 41.12,21.43 41.12,11.67 v37.94,8.49
MOSI2  (via drill 0.6)
  Top 0.406: ISP2.4 48.42,49.53 49.69,50.8 51.44,50.8 52.47,49.77 52.47,45.32 v52.23,45.32 | v50.24,40.88 50.24,38.18 49.69,37.62 48.81,37.62 U4.15
  Bottom 0.406: v52.23,45.32 52.23,42.86 v50.24,40.88
MOSI3
  Top 0.406: U6.15 86.45,60.23 87,59.69 93.03,59.69 98.42,54.29 99.69,54.29 100.33,54.93 100.33,57.02 ISP3.4
MOTOR_R  (via drill 0.6)
  Top 0.406: v35,71.36 35,70.96 34.21,70.17 34.21,69.4 IC1.5
  Bottom 0.406: T1.22/A8 17.78,59.13 19.84,61.2 22.54,61.2 30.48,69.14 32.78,69.14 v35,71.36
MOTOR_R_OUT  (via drill 0.6)
  Top 0.406: v39.45,87.47 39.45,84.85 35.32,80.72 v35.32,77.87 | v33.5,71.36 33.5,70.8 33.02,70.33 IC1.4
  Bottom 0.406: ETH1.P$2 35.54,91.58 34.45,90.49 34.45,89.46 35.72,88.19 38.73,88.19 v39.45,87.47 | v35.32,77.87 35.32,73.18 v33.5,71.36
MRX  (via drill 0.6)
  Top 0.406: U4.30 45.73,34.36 v46.83,33.26 | v51.28,28.97 51.51,28.97 54.37,26.11 54.37,24.53 U5.9
  Bottom 0.406: v46.83,33.26 46.99,33.26 v51.28,28.97
MRX12
  Top 0.406: U5.8 54.36,18.11 55.96,16.51 55.96,14.37 53.42,11.83 53.42,7.54 53.26,7.38 53.26,6.96 ETH4.P$2
MTX  (via drill 0.6)
  Top 0.406: U4.31 43.2,33.56 v43.89,32.86 | v50.01,26.99 51.36,26.99 53.02,25.32 53.02,24.52 U5.11
  Bottom 0.406: v43.89,32.86 44.13,32.86 v50.01,26.99
MTX12  (via drill 0.6)
  Top 0.406: U5.13 51.75,24.5 51.75,22.23 v51.91,22.07
  Bottom 0.406: ETH4.P$1 54.38,6.04 55.09,6.75 55.09,9.68 52.07,12.7 52.07,21.91 v51.91,22.07
MULTA
  Top 0.406: T1.3 17.94,43.18 19.29,44.53 23.26,44.53 24.05,43.74 24.05,42.47 24.77,41.75 27.07,41.75 28.57,40.24 U1.14
MULTB
  Top 0.406: U1.2 27.3,35.4 26.75,35.96 25.4,35.96 20.32,41.04 T1.4
MULTO1
  Top 0.406: T1.5 22.94,43.1 22.94,39.61 25.72,36.83 26.99,36.83 28.26,35.56 33.18,35.56 33.58,35.16 33.58,34.01 U1.7
  Bottom 0.406: T1.5 R1.1
MULTO2
  Top 0.406: R2.2 T1.2 15.72,43.18 18.02,45.48 30,45.48 31.75,43.74 31.75,42.55 32.54,41.75 33.97,41.75 34.92,40.8 U1.9
N$1
  Top 0.406: U4.7 46.45,30.31 46.83,29.92 51.04,29.92 53.66,32.54 53.66,36.51 Y2.2
  Bottom 0.406: C11.1 52.15,38.18 Y2.2
N$2
  Top 0.406: U4.8 50.32,31.27 Y2.1
  Bottom 0.406: C12.1 Y2.1
N$3
  Top 0.406: C14.1 50.46,20.74 51.12,20.08 51.12,18.68 U5.3
N$4
  Top 0.406: U3.7 22.32,9.43 Y1.2
  Bottom 0.406: C7.1 22.01,9.74 Y1.2
N$5
  Top 0.406: U3.8 25.14,8.63 Y1.1
  Bottom 0.406: C8.1 22.44,5.93 Y1.1
N$6
  Top 0.406: U5.2 50.44,17.82 49.93,17.3 49.05,17.3 48.42,16.67 48.42,15.93 C16.1
N$7
  Top 0.406: C16.2 50.16,15.88 51.75,17.46 51.75,18.66 U5.4
N$8
  Top 0.406: C13.1 52.49,17.36 52.39,17.46 52.39,18.66 U5.5
N$9
  Top 0.406: U5.6 53.03,17.69 54.13,16.59 54.13,15.93 C13.2
N$10
  Top 0.406: U5.7 53.7,19.88 54.53,20.72 56.49,20.72 C15.1
N$11
  Top 0.813: F9.2 63.37,81.15 63.18,80.96 63.18,90.17 63.82,90.81 63.82,92.13 ETH7.P$6
N$12
  Top 0.406: F10.2 73.53,88.71 71.75,90.49 67.5,90.49 ETH7.P$8
N$13
  Top 1.778: F7.2 FAN1.5_2 FAN1.5
N$14
  Top 1.778: F8.2 110.89,25.64 FAN1.12_2 | FAN1.12_2 FAN1.12_3 | FAN1.12_2 FAN1.12
N$15
  Top 0.813: F4.2 83.95,84.96 E1.2 E1.1
N$16
  Top 0.406: R23.2 88.84,67.31 U6.23
N$18
  Top 0.406: R24.2 90.08,69.53 U6.24
N$19  (via drill 0.6)
  Top 0.406: v87.95,72.07 87.95,70.39 U6.25
  Bottom 0.406: R25.2 87.84,72.17 v87.95,72.07
N$20
  Top 0.406: U6.26 86.45,71.44 R26.2
N$21  (via drill 0.6)
  Top 0.406: U6.19 89.47,64.2 89.85,63.82 89.85,62.23 90.17,61.91 92.08,61.91 v92.39,62.23
  Bottom 0.406: v92.39,62.23 92.39,63.72 R27.2
N$22  (via drill 0.6)
  Top 0.406: v91.12,66.04 90.17,66.04 89.53,66.67 88.82,66.67 U6.22
  Bottom 0.406: R28.2 v91.12,66.04
N$23
  Top 0.813: F2.1 7.49,58.55 T1.VIN
N$24
  Top 1.27: F5.2 E2.1 E2.2
N$25
  Top 0.813: E2.4 11.19,76.2 9.76,74.77 9.76,70.48 10.87,69.37 13.49,69.37 E2.3 16.78,69.85 F6.2
N$26  (via drill 0.6)
  Top 0.406: F1.1 13.65,65.41 12.7,64.45 T1.3.3V 12.7,54.61 15.24,52.07 v28.26,52.07 | T1.3.3V1 36.51,48.26 v32.07,52.7
  Bottom 0.406: v32.07,52.7 31.75,53.02 29.21,53.02 v28.26,52.07
N$27
  Bottom 0.406: F3.2 12.54,29.21 9.68,26.35 6.9,26.35 ETH3.P$1
N$28
  Top 0.406: U6.30 83.19,69.77 83.19,70.48 83.5,70.8 83.5,71.86 R29.2
N$29  (via drill 0.6)
  Top 0.406: v82.55,71.12 82.55,69.79 U6.31
  Bottom 0.406: R30.2 82.23,71.44 v82.55,71.12
N$30
  Top 0.406: R31.2 80.96,70.39 U6.32
N$31
  Top 0.406: R32.2 79.79,68.58 U6.1
N$32
  Top 0.406: R33.2 76.28,66.36 77.39,67.47 80.1,67.47 U6.2
N$33
  Top 0.406: R34.2 81.59,61.17 U6.9
N$34  (via drill 0.6)
  Top 0.406: R34.1 80.01,58.1 v78.74,56.83 | v74.3,55.24 74.3,57.15 71.12,60.33 69.22,60.33 62.87,53.98 LED12.A
  Bottom 0.406: v78.74,56.83 78.42,56.83 76.2,54.61 74.93,54.61 v74.3,55.24
N$35  (via drill 0.6)
  Top 0.406: LED11.A 63.18,55.88 v69.22,61.91 | v71.44,64.14 71.44,65.41 72.39,66.36 R33.1
  Bottom 0.406: v69.22,61.91 v71.44,64.14
N$36  (via drill 0.6)
  Top 0.406: LED10.A 63.18,57.78 v68.26,62.87 | v70.48,65.09 70.48,68.58 72.39,70.48 75.88,70.48 76.52,69.85 76.52,68.68 R32.1
  Bottom 0.406: v68.26,62.87 v70.48,65.09
N$37  (via drill 0.6)
  Top 0.406: LED9.A 63.18,59.69 v67.31,63.82 | v69.53,66.04 69.53,69.85 v70.17,70.48 | v70.48,73.34 80.75,73.34 R31.1
  Bottom 0.406: v67.31,63.82 v69.53,66.04 | v70.17,70.48 70.17,73.03 v70.48,73.34
N$38  (via drill 0.6)
  Top 0.406: v82.55,75.25 84.77,75.25 85.41,75.88 95.57,75.88 96.84,77.15 96.84,84.45 96.52,84.77 96.52,89.85 98.42,91.76 LED8.A
  Bottom 0.406: R30.1 82.23,74.93 v82.55,75.25
N$39
  Top 0.406: LED7.A 100.33,92.08 97.16,88.9 97.16,85.09 97.47,84.77 97.47,76.83 95.89,75.25 85.72,75.25 84.35,73.88 R29.1
N$40  (via drill 0.6)
  Top 0.406: v96.2,66.04 105.41,75.25 105.41,89.85 102.23,93.03 LED6.A
  Bottom 0.406: R28.1 v96.2,66.04
N$41  (via drill 0.6)
  Top 0.406: v95.89,63.82 106.36,74.3 106.36,91.76 104.14,93.98 LED5.A
  Bottom 0.406: R27.1 v95.89,63.82
N$42
  Top 0.406: R26.1 87.21,73.24 88.58,74.61 97.16,74.61 98.11,75.56 98.11,85.63 LED4.A
N$43  (via drill 0.6)
  Top 0.406: LED3.A 100.33,74.93 99.06,73.66 v89.22,73.66
  Bottom 0.406: v89.22,73.66 87.21,73.66 R25.1
N$44
  Top 0.406: LED2.A 102.23,74.61 97.16,69.53 R24.1
N$45
  Top 0.406: LED1.A 104.14,75.25 96.52,67.63 92.61,67.63 R23.1
N$46
  Top 0.406: ETH5.P$3 75.44,5.75 74.06,4.37 71.36,4.37 68.5,7.22 68.5,9.45 71.2,12.14 71.2,15.69 R19.1
N$73
  Top 0.406: C3.1 19.66,28.92 19.92,28.65 20.72,28.65 U2.3
N$74  (via drill 0.6)
  Top 0.406: U2.2 21.95,29.33 v22.54,29.92
  Bottom 0.406: v22.54,29.92 23.99,29.92 C6.1
N$75  (via drill 0.6)
  Top 0.406: v22.46,28.02 20.75,28.02 U2.4
  Bottom 0.406: C6.2 22.8,28.36 v22.46,28.02
N$76  (via drill 0.6)
  Top 0.406: v18.49,27.3 20.67,27.3 U2.5
  Bottom 0.406: C1.1 17.76,26.57 v18.49,27.3
N$77  (via drill 0.6)
  Top 0.406: v18.89,26.19 19.13,26.19 19.61,26.67 20.67,26.67 U2.6
  Bottom 0.406: C1.2 17.57,24.87 v18.89,26.19
N$78
  Top 0.406: U2.7 22.34,26.08 23.18,25.24 C4.1
PURGE_V  (via drill 0.6)
  Top 0.406: M1.IN2 81.28,43.5 80.25,42.47 46.99,42.47 v46.04,41.51
  Bottom 0.406: v46.04,41.51 46.04,41.43 45.24,40.64 34.61,40.64 33.02,42.23 T1.9
PURGE_V_G
  Top 0.406: M1.OUT2 R16.2
  Bottom 0.61: M1.OUT2 81.28,18.89 82.71,17.46 93.03,17.46 97.79,12.7 97.79,8.96 ETH6.P$4
RX1  (via drill 0.6)
  Top 0.406: v118.11,47.31 61.59,47.31 53.98,54.93 47.31,54.93 41.91,49.53 36.51,49.53 v35.24,50.8 | T1.0 10.16,46.99 14.29,51.12 27.3,51.12 28.26,50.16 v29.53,50.16
  Bottom 0.406: CAN1.TX0 122.75,51.94 v118.11,47.31 | v35.24,50.8 30.16,50.8 v29.53,50.16
RX3
  Bottom 0.406: O1.P$3 11.27,15.88 9.29,17.86 3.57,17.86 1.59,19.84 1.59,41.67 6.91,46.99 6.83,47.07 6.83,50.88 7.54,51.59 22.62,51.59 27.86,46.35 27.86,43.26 T1.7
SCK1
  Top 0.406: ISP1.3 33.15,24.24 34.37,23.02 34.37,18.34 37.47,15.24 37.47,9.53 36.67,8.73 34.87,8.73 U3.17
SCK2  (via drill 0.6)
  Top 0.406: ISP2.3 50.67,48.77 49.69,47.78 49.69,45.32 v49.45,45.09 | v47.47,41.43 47.47,40.07 U4.17
  Bottom 0.406: v49.45,45.09 49.45,43.42 v47.47,41.43
SCK3
  Top 0.406: ISP3.3 101.6,56.2 102.87,57.47 102.87,59.05 101.92,60.01 94.61,60.01 93.66,60.96 89.85,60.96 88.9,61.91 88.9,62.45 U6.17
SCL  (via drill 0.6)
  Top 0.406: 39.45,68.58 RTC1.P$3 57.15,68.58 SHT1.SCL 60.01,71.44 68.58,71.44 | 39.45,68.58 39.37,68.58 | R3.2 T1.19/A5 26.27,58.42 v29.21,61.36 | 68.58,71.44 77.79,71.44 80.01,69.22 80.64,69.22 81.92,67.94 83.82,67.94 84.77,68.9 84.77,69.61 U6.28 | 68.58,71.44 68.58,65.41 81.28,52.7 LCD1.SCL 82.87,50.48 131.37,50.48 150.89,30.96 156.37,30.96 FAN1.SCL | U4.28 38.65,35.96 37.74,36.87 | 37.74,36.87 35.88,38.73 35.88,40.96 34.29,42.55 34.29,47.62 v28.26,53.66 | v33.18,62.31 39.45,68.58 | U3.28 30.88,18.58 v31.35,19.05 | v38.97,21.99 38.97,28.65 37.62,30 37.62,36.75 37.74,36.87
  Bottom 0.406: v28.26,53.66 28.26,53.92 R3.2 T1.19/A5 | v29.21,61.36 32.23,61.36 v33.18,62.31 | v31.35,19.05 36.91,19.05 38.97,21.11 v38.97,21.99
SDA  (via drill 0.6)
  Top 0.406: R4.2 T1.18/A4 40.64,71.12 RTC1.P$4 57.15,71.12 SHT1.SDA v67.31,72.39 78.11,72.39 v80.01,70.48 | v85.09,67.94 85.72,68.58 85.72,69.63 U6.27 | v67.31,70.48 67.31,65.41 78.74,53.98 LCD1.SDA 81.12,49.69 81.28,49.53 81.36,49.45 128.35,49.45 149.86,27.94 FAN1.SDA | U4.27 38.8,36.76 37.42,38.14 | 37.42,38.14 36.83,38.73 36.83,46.67 v29.53,53.98 | U3.27 31.68,17.47 v31.99,17.78 | v40.01,21.11 40.01,28.97 38.5,30.48 v38.5,31.19 | v37.62,38.73 37.62,38.34 37.42,38.14
  Bottom 0.406: v80.01,70.48 82.55,67.94 v85.09,67.94 | v67.31,70.48 v67.31,72.39 | v29.53,53.98 27.94,55.56 T1.18/A4 | v31.99,17.78 34.53,17.78 35.08,18.34 37.23,18.34 v40.01,21.11 | v38.5,31.19 38.5,31.51 36.43,33.58 36.43,37.54 v37.62,38.73
START_R  (via drill 0.6)
  Top 0.406: T1.21/A7 20.32,61.59 v21.75,63.02 | v28.18,69.61 28.89,69.61 29.13,69.85 29.13,69.4 IC1.1
  Bottom 0.406: v21.75,63.02 22.7,63.02 27.38,67.71 27.38,68.82 v28.18,69.61
START_R_OUT  (via drill 0.6)
  Top 0.406: v32.86,91.68 32.86,90.33 34.92,88.27 34.92,85.72 31.99,82.79 v31.99,77.79 | IC1.3 31.75,71.04 v31.99,71.28
  Bottom 0.406: v32.86,91.68 34.53,93.34 ETH1.P$1 | v31.99,71.28 v31.99,77.79
SUPPLY_V  (via drill 0.6)
  Top 0.406: v25.8,47.07 28.65,47.07 29.05,46.67 31.91,46.67 v31.99,46.59 | v47.94,54.05 53.42,54.05 61.2,46.28 68.9,46.28 v69.29,45.88
  Bottom 0.406: T1.6 25.4,46.67 v25.8,47.07 | v31.99,46.59 35.64,46.59 37.62,44.61 39.29,44.61 39.45,44.45 42.78,44.45 46.75,48.42 46.75,52.86 v47.94,54.05 | v69.29,45.88 72.79,42.39 83.34,42.39 84.22,43.26 84.22,45.32 M1.IN1
SUPPLY_V_G
  Top 0.406: M1.OUT1 R17.2
  Bottom 0.61: M1.OUT1 93.19,19.05 99.14,13.1 99.14,8.27 ETH6.P$2
TX1  (via drill 0.6)
  Top 0.406: v118.11,48.58 61.59,48.58 54.29,55.88 45.72,55.88 41.91,52.07 v34.61,52.07 | v26.99,50.16 14.61,50.16 13.02,48.58 13.02,43.5 T1.1
  Bottom 0.406: v118.11,48.58 120.21,50.67 CAN1.RXI | v34.61,52.07 33.34,52.07 32.7,51.44 29.21,51.44 27.94,50.16 v26.99,50.16
TX3  (via drill 0.6)
  Top 0.406: O1.P$2 13.97,15.95 14.13,16.11 14.13,16.35 12.7,17.78 4.84,17.78 1.51,21.11 1.51,52.07 v2.38,52.94
  Bottom 0.406: v2.38,52.94 24.69,52.94 25.4,52.23 25.4,50.01 27.07,48.34 28.5,48.34 30.48,46.35 T1.8
VDD
  Top 0.406: SJ2.2 29.09,75.34 IC1.14
VSS
  Top 0.406: IC1.7 37.03,69.32 SJ1.2